# EAGLE design sm_RGB (EAGLE 5.11)

## Sheet 1 of 2
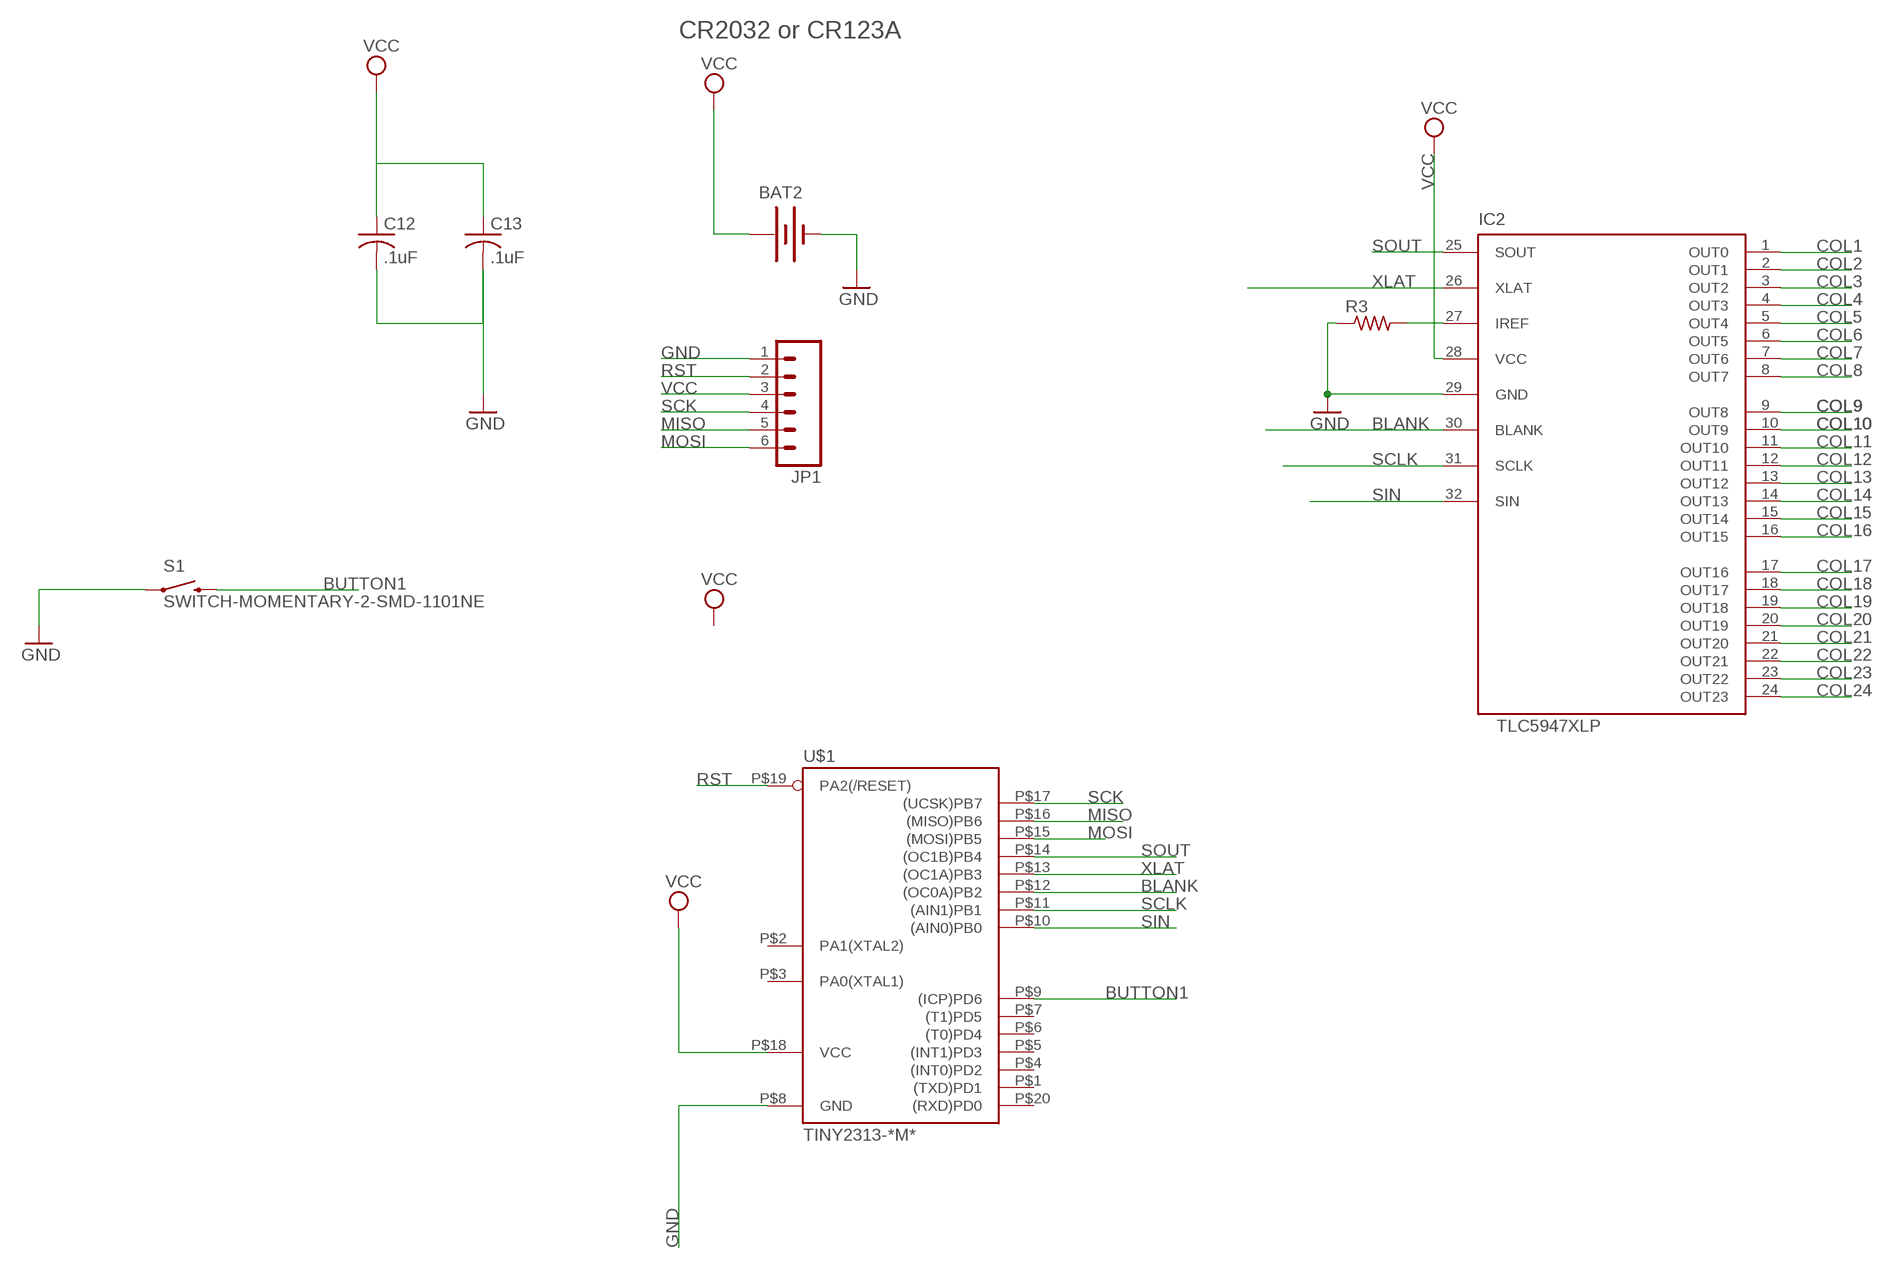
[diagram p0: schematic, sheet 1]

### Parts
BAT2  BATTERYCR123A  [BATTERY_CR123A]
C12  .1uF  C-USC0402  [C0402]
C13  .1uF  C-USC0805  [C0805]
IC2  TLC5947XLP  [QFN32_XLP]
JP1  M06SMD-FEMALE-V2  [1X06-SMD-FEMALE-V2]
R3  R-US_R0402  [R0402]
S1  SWITCH-MOMENTARY-2-SMD-1101NE  [TACTILE-SWITCH-1101NE]
U$1  TINY2313-*M*  [MLF20]

### Nets
BLANK: IC2.30(BLANK) U$1.P$12((OC0A)PB2)
BUTTON1: S1.P$2 U$1.P$9((ICP)PD6)
COL1: IC2.1(OUT0) ; also sheet 2
COL2: IC2.2(OUT1) ; also sheet 2
COL3: IC2.3(OUT2) ; also sheet 2
COL4: IC2.4(OUT3) ; also sheet 2
COL5: IC2.5(OUT4) ; also sheet 2
COL6: IC2.6(OUT5) ; also sheet 2
COL7: IC2.7(OUT6) ; also sheet 2
COL8: IC2.8(OUT7) ; also sheet 2
COL9: IC2.9(OUT8) ; also sheet 2
COL10: IC2.10(OUT9) ; also sheet 2
COL11: IC2.11(OUT10) ; also sheet 2
COL12: IC2.12(OUT11) ; also sheet 2
COL13: IC2.13(OUT12) ; also sheet 2
COL14: IC2.14(OUT13) ; also sheet 2
COL15: IC2.15(OUT14) ; also sheet 2
COL16: IC2.16(OUT15) ; also sheet 2
COL17: IC2.17(OUT16) ; also sheet 2
COL18: IC2.18(OUT17) ; also sheet 2
COL19: IC2.19(OUT18) ; also sheet 2
COL20: IC2.20(OUT19) ; also sheet 2
COL21: IC2.21(OUT20) ; also sheet 2
COL22: IC2.22(OUT21) ; also sheet 2
COL23: IC2.23(OUT22) ; also sheet 2
COL24: IC2.24(OUT23) ; also sheet 2
GND: BAT2.- C12.2 C13.2 IC2.29(GND) JP1.1 R3.1 S1.P$1 U$1.P$8(GND)
MISO: JP1.5 U$1.P$16((MISO)PB6)
MOSI: JP1.6 U$1.P$15((MOSI)PB5)
N$13: IC2.27(IREF) R3.2
RST: JP1.2 U$1.P$19(PA2(/RESET))
SCK: JP1.4 U$1.P$17((UCSK)PB7)
SCLK: IC2.31(SCLK) U$1.P$11((AIN1)PB1)
SIN: IC2.32(SIN) U$1.P$10((AIN0)PB0)
SOUT: IC2.25(SOUT) U$1.P$14((OC1B)PB4)
VCC: BAT2.+ C12.1 C13.1 IC2.28(VCC) JP1.3 U$1.P$18(VCC) ; also sheet 2
XLAT: IC2.26(XLAT) U$1.P$13((OC1A)PB3)
Unconnected: U$1.P$1((TXD)PD1) U$1.P$2(PA1(XTAL2)) U$1.P$3(PA0(XTAL1)) U$1.P$4((INT0)PD2) U$1.P$5((INT1)PD3) U$1.P$6((T0)PD4) U$1.P$7((T1)PD5) U$1.P$20((RXD)PD0)

### Notes on the sheet
- CR2032 or CR123A

## Sheet 2 of 2
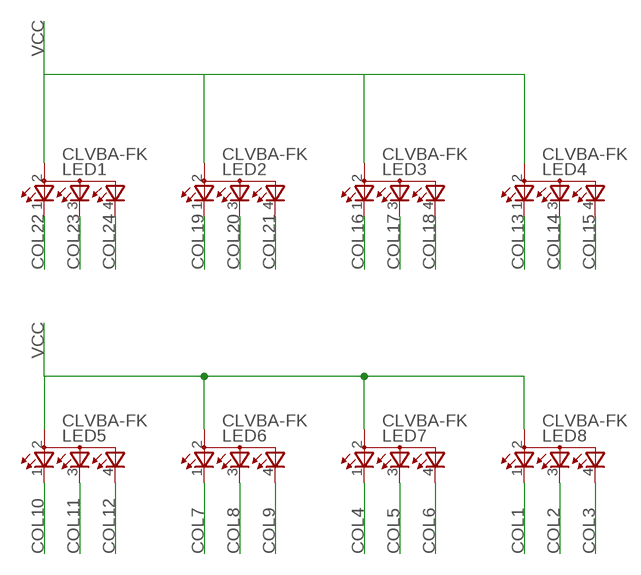
[diagram p1: schematic, sheet 2]

### Parts
LED1  CLVBA-FK  [PLCC4]
LED2  CLVBA-FK  [PLCC4]
LED3  CLVBA-FK  [PLCC4]
LED4  CLVBA-FK  [PLCC4]
LED5  CLVBA-FK  [PLCC4]
LED6  CLVBA-FK  [PLCC4]
LED7  CLVBA-FK  [PLCC4]
LED8  CLVBA-FK  [PLCC4]

### Nets
COL1: LED8.1(CRED) ; also sheet 1
COL2: LED8.3(CBLUE) ; also sheet 1
COL3: LED8.4(CGREEN) ; also sheet 1
COL4: LED7.1(CRED) ; also sheet 1
COL5: LED7.3(CBLUE) ; also sheet 1
COL6: LED7.4(CGREEN) ; also sheet 1
COL7: LED6.1(CRED) ; also sheet 1
COL8: LED6.3(CBLUE) ; also sheet 1
COL9: LED6.4(CGREEN) ; also sheet 1
COL10: LED5.1(CRED) ; also sheet 1
COL11: LED5.3(CBLUE) ; also sheet 1
COL12: LED5.4(CGREEN) ; also sheet 1
COL13: LED4.1(CRED) ; also sheet 1
COL14: LED4.3(CBLUE) ; also sheet 1
COL15: LED4.4(CGREEN) ; also sheet 1
COL16: LED3.1(CRED) ; also sheet 1
COL17: LED3.3(CBLUE) ; also sheet 1
COL18: LED3.4(CGREEN) ; also sheet 1
COL19: LED2.1(CRED) ; also sheet 1
COL20: LED2.3(CBLUE) ; also sheet 1
COL21: LED2.4(CGREEN) ; also sheet 1
COL22: LED1.1(CRED) ; also sheet 1
COL23: LED1.3(CBLUE) ; also sheet 1
COL24: LED1.4(CGREEN) ; also sheet 1
VCC: LED1.2(A2) LED2.2(A2) LED3.2(A2) LED4.2(A2) LED5.2(A2) LED6.2(A2) LED7.2(A2) LED8.2(A2) ; also sheet 1

## Library data of the parts
BAT2 = 8x8:BATTERY: Battery Holders Various common sizes : AA, AAA, 20mm coin cell and 12mm coin cell.
C12 C13 = rcl:C-US: CAPACITOR, American symbol
IC2 = slice_noshift:TLC5947
JP1 = 8x8:M06
LED1-LED8 = rf_blinky:CLVBA-FK
R3 = rcl:R-US_: RESISTOR, American symbol
S1 = CPLD_Class:SWITCH-MOMENTARY-2
U$1 = NSL_Cylon:TINY2313*: Atmel Tiny2313 2K Flash, 128 bytes EEPROM, 128 bytes RAM

## Board
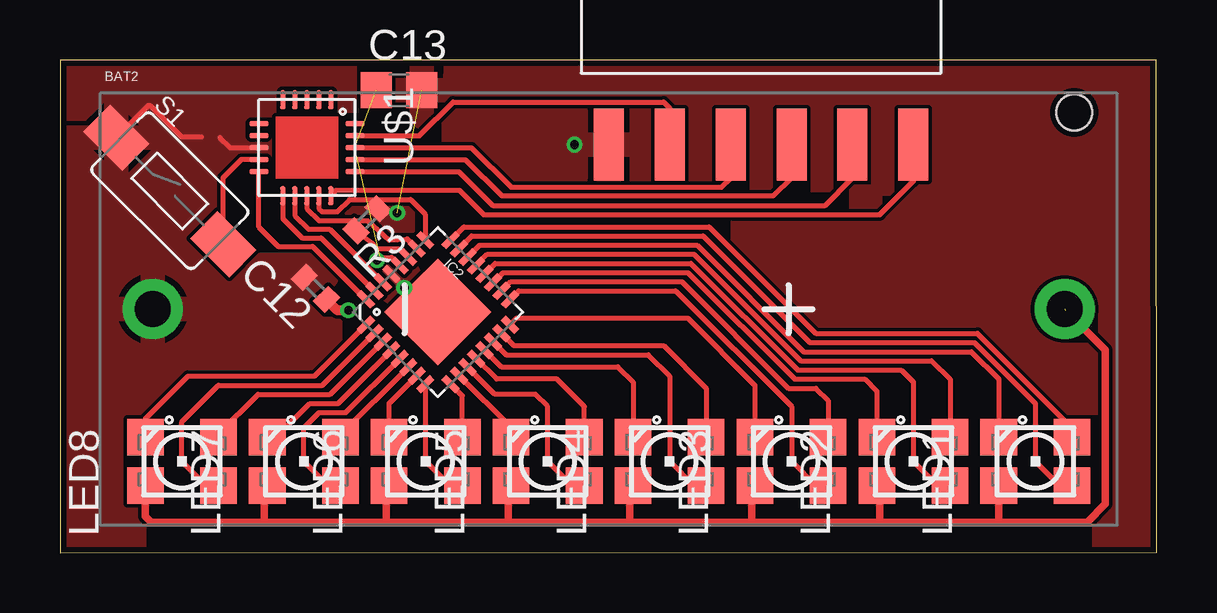
[diagram p2: board, top side]
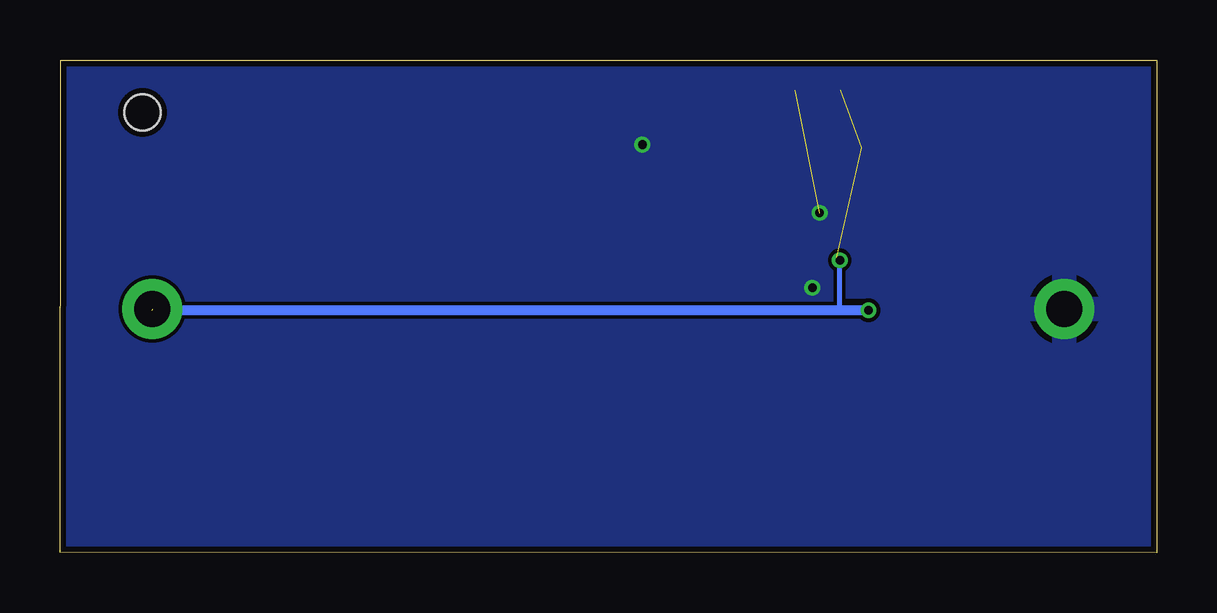
[diagram p3: board, bottom side, seen from below]

Size 45.7 x 20.55 mm. Coordinates in mm from the lower left corner, seen from the top.
Outline: 0,0 45.7,0.03 45.67,20.55 0,20.55 0,0
Copper layers (1*16): Top 0.035mm / dielectric 1.5mm / Bottom 0.035mm
Design rules "ITead_rule": minimum track width 6mil, minimum drill 12mil, track to track 6mil, track to pad 6mil, pad to pad 6mil, via to via 6mil, smd to smd 0mil, copper to edge 10mil, drill to drill 10mil, minimum pad ring 10mil, minimum via ring 6mil, stop-mask expansion 2mil, vias tented up to drill 100mil, thermal gap 10mil

### Footprints (pad centres in the part's own frame; a part is rotated, then mirrored left to right if it is on the bottom)
BATTERY_CR123A = drill 1.5 pad 2.5 round: + 19,0; - -19,0 | hole 1.5: 19.4,8.2
C0402 = smd 0.7 x 0.9: 1 -0.65,0; 2 0.65,0
C0805 = smd 1.3 x 1.5: 1 -0.95,0; 2 0.95,0
QFN32_XLP = smd 0.285 x 0.8: 1 -1.75,-2.5; 2 -1.25,-2.5; 3 -0.75,-2.5; 4 -0.25,-2.5; 5 0.25,-2.5; 6 0.75,-2.5; 7 1.25,-2.5; 8 1.75,-2.5; 17 1.75,2.5; 18 1.25,2.5; 19 0.75,2.5; 20 0.25,2.5; 21 -0.25,2.5; 22 -0.75,2.5; 23 -1.25,2.5; 24 -1.75,2.5 | smd 0.8 x 0.285: 9 2.5,-1.75; 10 2.5,-1.25; 11 2.5,-0.75; 12 2.5,-0.25; 13 2.5,0.25; 14 2.5,0.75; 15 2.5,1.25; 16 2.5,1.75; 25 -2.5,1.75; 26 -2.5,1.25; 27 -2.5,0.75; 28 -2.5,0.25; 29 -2.5,-0.25; 30 -2.5,-0.75; 31 -2.5,-1.25; 32 -2.5,-1.75 | smd 3.15 x 3.15: EP 0,0
1X06-SMD-FEMALE-V2 = smd 1.25 x 3: 1 6.35,3.425; 2 3.81,3.425; 3 1.27,3.425; 4 -1.27,3.425; 5 -3.81,3.425; 6 -6.35,3.425
PLCC4 = smd 1.524 x 1.524: 1 -1.524,1.016; 2 -1.524,-1.016; 3 1.524,-1.016; 4 1.524,1.016
R0402 = smd 0.7 x 0.9: 1 -0.65,0; 2 0.65,0
TACTILE-SWITCH-1101NE = smd 2.3 x 1.6: P$1 -3.15,0; P$2 3.15,0
MLF20 = smd 0.8 x 0.23: P$1 -2,1; P$2 -2,0.5; P$3 -2,0; P$4 -2,-0.5; P$5 -2,-1; P$11 2,-1; P$12 2,-0.5; P$13 2,0; P$14 2,0.5; P$15 2,1 | smd 0.23 x 0.8: P$6 -1,-2; P$7 -0.5,-2; P$8 0,-2; P$9 0.5,-2; P$10 1,-2; P$16 1,2; P$17 0.5,2; P$18 0,2; P$19 -0.5,2; P$20 -1,2

### Placement (x,y rotation side)
BAT2  22.86,10.16 0 top
C12  10.64,11.02 135 top
C13  14.12,19.28 0 top
IC2  15.75,10.03 315 top
JP1  29.21,20.45 180 top
LED1  40.64,3.81 0 top
LED2  35.56,3.81 0 top
LED3  30.48,3.81 0 top
LED4  25.4,3.81 0 top
LED5  20.32,3.81 0 top
LED6  15.24,3.81 0 top
LED7  10.16,3.81 0 top
LED8  5.08,3.81 0 top
R3  12.79,13.89 225 top
S1  4.57,15.09 315 top
U$1  10.29,16.89 270 top

### Tracks (layer width: path | path; a pad name or v marks a point on that pad's centre or on a via)
BLANK
  Top 0.203: IC2.30 11.23,13.49 10.36,13.49 9.79,14.06 U$1.P$12
BUTTON1
  Top 0.203: U$1.P$9 8.27,16.41 7.57,16.41 6.8,15.64 S1.P$2
COL1
  Top 0.203: IC2.1 10.61,7.37 5.33,7.37 3.56,5.59 LED8.1
COL2
  Top 0.203: IC2.2 10.93,6.99 6.6,6.99 5.08,5.46 5.08,3.81 6.1,2.79 LED8.3
COL3
  Top 0.203: IC2.3 11.26,6.6 8.26,6.6 6.6,4.95 LED8.4
COL4
  Top 0.203: IC2.4 11.58,6.22 10.41,6.22 9.02,4.83 LED7.1
COL5
  Top 0.203: IC2.5 11.91,5.84 10.79,5.84 10.16,5.21 10.16,3.81 11.18,2.79 LED7.3
COL6
  Top 0.203: IC2.6 11.68,4.91 LED7.4
COL7
  Top 0.203: IC2.7 13.72,6.23 LED6.1
COL8
  Top 0.203: IC2.8 15.24,7 15.24,3.81 16.26,2.79 LED6.3
COL9
  Top 0.203: IC2.9 16.76,6.54 LED6.4
COL10
  Top 0.203: IC2.10 18.8,5.22 LED5.1
COL11
  Top 0.203: IC2.11 18.12,6.6 19.81,6.6 20.32,6.1 20.32,3.81 21.34,2.79 LED5.3
COL12
  Top 0.203: IC2.12 18.19,7.24 20.7,7.24 21.84,6.1 LED5.4
COL13
  Top 0.203: IC2.13 18.39,7.75 23.24,7.75 23.88,7.11 LED4.1
COL14
  Top 0.203: IC2.14 18.59,8.26 24.51,8.26 25.4,7.37 25.4,3.81 26.42,2.79 LED4.3
COL15
  Top 0.203: IC2.15 18.91,8.64 25.15,8.64 26.92,6.86 LED4.4
COL16
  Top 0.203: IC2.16 19.03,9.78 26.16,9.78 28.96,6.99 LED3.1
COL17
  Top 0.203: IC2.17 19.11,10.92 25.65,10.92 30.48,6.1 30.48,3.81 31.5,2.79 LED3.3
COL18
  Top 0.203: IC2.18 18.79,11.3 25.91,11.3 30.35,6.86 31.5,6.86 32,6.35 LED3.4
COL19
  Top 0.203: IC2.19 18.46,11.68 26.16,11.68 30.61,7.24 33.53,7.24 34.04,6.73 LED2.1
COL20
  Top 0.203: IC2.20 18.13,12.06 26.29,12.06 30.73,7.62 35.05,7.62 35.56,7.11 35.56,3.81 36.58,2.79 LED2.3
COL21
  Top 0.203: IC2.21 17.81,12.45 26.42,12.45 30.86,8 36.32,8 37.08,7.24 LED2.4
COL22
  Top 0.203: IC2.22 17.48,12.83 26.54,12.83 30.99,8.38 37.97,8.38 39.12,7.24 LED1.1
COL23
  Top 0.203: IC2.23 17.16,13.21 26.8,13.21 31.24,8.76 38.1,8.76 40.64,6.22 40.64,3.81 41.66,2.79 LED1.3
COL24
  Top 0.203: IC2.24 16.83,13.59 27.05,13.59 31.5,9.14 38.23,9.14 42.16,5.21 LED1.4
GND  (via drill 0.36)  (1 unrouted)
  Top 0.203: IC2.29 14.35,11.08 v14.35,11.05 | R3.1 14.05,14.15 v14.05,14.17 | U$1.P$8 7.09,16.89 6.66,17.32 | S1.P$1 3.67,18.64 3.76,18.64 5.05,17.35 5.89,17.35
  other vias: 21.44,17.02
  pour Top: -0.71,21.36 46.63,21.36 46.63,-1.32 -0.74,-1.32 -0.74,21.39
  pour Bottom: -0.36,21.16 46.1,21.16 46.1,-0.36 -0.36,-0.36
MISO
  Top 0.203: JP1.5 33.02,15.62 31.88,14.48 18.03,14.48 16.62,15.89 U$1.P$16
MOSI
  Top 0.203: JP1.6 35.56,15.49 34.16,14.1 17.65,14.1 16.64,15.11 11.51,15.11 U$1.P$15
N$13
  Top 0.203: IC2.27 14.27,12.57 14.22,12.57 14.1,12.68 13.21,12.68 12.96,12.94 R3.2
RST
  Top 0.203: JP1.2 25.4,18.54 25.15,18.8 16.38,18.8 14.98,17.39 U$1.P$19
SCK
  Top 0.203: U$1.P$17 12.3,16.38 16.89,16.38 18.41,14.88 29.72,14.88 30.48,15.65 JP1.4
SCLK
  Top 0.203: IC2.31 10.88,13.13 10.08,13.13 9.29,13.93 U$1.P$11
SIN
  Top 0.203: IC2.32 10.53,12.78 9.09,12.78 8.29,13.58 U$1.P$10
SOUT
  Top 0.203: IC2.25 15.22,14.12 14.61,14.73 12.06,14.73 11.56,14.22 10.92,14.22 10.79,14.36 U$1.P$14
VCC  (via drill 0.36)  (3 unrouted)
  Top 0.203: JP1.3 27.94,15.62 27.56,15.24 18.8,15.24 17.14,16.89 U$1.P$18 | IC2.28 13.82,12.32 13.34,12.32 v13.21,12.19
  Top 0.305: LED8.2 3.56,1.52 3.81,1.27 8.51,1.27 | 8.51,1.27 13.59,1.27 | 13.59,1.27 18.67,1.27 | 18.67,1.27 23.75,1.27 | 23.75,1.27 28.83,1.27 | 28.83,1.27 34.16,1.27 | LED7.2 8.51,2.67 8.51,1.27 | LED6.2 13.59,2.67 13.59,1.27 | LED5.2 18.67,2.67 18.67,1.27 | LED4.2 23.75,2.67 23.75,1.27 | LED3.2 28.83,2.67 28.83,1.27 | LED2.2 34.16,2.67 34.16,1.27 | BAT2.+ 43.56,8.46 43.56,2.03 42.8,1.27 39.12,1.27 | 34.16,1.27 39.12,1.27 | 39.12,1.27 LED1.2
  Top 0.406: v12.01,10.11 11.56,10.11 C12.1
  Bottom 0.203: 13.21,10.11 v13.21,12.19
  Bottom 0.406: v12.01,10.11 13.21,10.11 41.88,10.11
XLAT
  Top 0.203: IC2.26 14.47,13.08 14.48,13.08 13.72,13.03 12.83,13.84 10.79,13.84 10.29,14.35 U$1.P$13